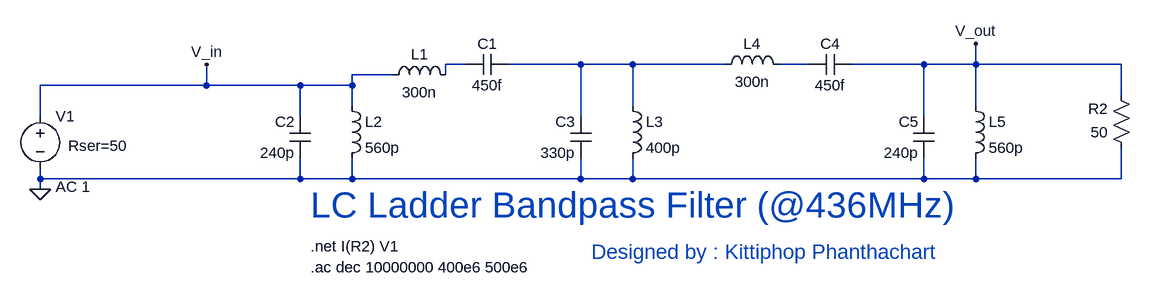
[diagram p0: schematic Bandpass 5 order fc 436.asc]
Bandpass 5 order fc 436.asc, the LTspice schematic file:
Version 4
SHEET 1 2124 680
WIRE 816 32 784 32
WIRE 992 32 880 32
WIRE 1072 32 992 32
WIRE 1216 32 1072 32
WIRE 1344 32 1296 32
WIRE 1520 32 1408 32
WIRE 1600 32 1600 0
WIRE 1600 32 1520 32
WIRE 1824 32 1600 32
WIRE 704 48 640 48
WIRE 784 48 784 32
WIRE 416 64 416 32
WIRE 416 64 160 64
WIRE 560 64 416 64
WIRE 640 64 640 48
WIRE 640 64 560 64
WIRE 1824 80 1824 32
WIRE 640 96 640 64
WIRE 1072 96 1072 32
WIRE 1600 96 1600 32
WIRE 160 112 160 64
WIRE 560 112 560 64
WIRE 992 112 992 32
WIRE 1520 112 1520 32
WIRE 160 208 160 192
WIRE 560 208 560 176
WIRE 560 208 160 208
WIRE 640 208 640 176
WIRE 640 208 560 208
WIRE 992 208 992 176
WIRE 992 208 640 208
WIRE 1072 208 1072 176
WIRE 1072 208 992 208
WIRE 1520 208 1520 176
WIRE 1520 208 1072 208
WIRE 1600 208 1600 176
WIRE 1600 208 1520 208
WIRE 1824 208 1824 160
WIRE 1824 208 1600 208
WIRE 160 224 160 208
FLAG 160 224 0
FLAG 1600 0 V_out
FLAG 416 32 V_in
DATAFLAG 480 64 "V(v_in)"
SYMBOL voltage 160 96 R0
WINDOW 123 24 124 Left 2
WINDOW 39 43 61 Left 2
SYMATTR Value2 AC 1
SYMATTR SpiceLine Rser=50
SYMATTR InstName V1
SYMATTR Value ""
SYMBOL res 1840 176 R180
WINDOW 0 36 76 Left 2
WINDOW 3 36 40 Left 2
SYMATTR InstName R2
SYMATTR Value 50
SYMBOL ind 688 64 R270
WINDOW 0 32 56 VTop 2
WINDOW 3 5 56 VBottom 2
SYMATTR InstName L1
SYMATTR Value 300n
SYMBOL cap 880 16 R90
WINDOW 0 0 32 VBottom 2
WINDOW 3 32 32 VTop 2
SYMATTR InstName C1
SYMATTR Value 450f
SYMBOL cap 576 176 R180
WINDOW 0 24 56 Left 2
WINDOW 3 24 8 Left 2
SYMATTR InstName C2
SYMATTR Value 240p
SYMBOL cap 1008 176 R180
WINDOW 0 24 56 Left 2
WINDOW 3 24 8 Left 2
SYMATTR InstName C3
SYMATTR Value 330p
SYMBOL ind 624 80 R0
SYMATTR InstName L2
SYMATTR Value 560p
SYMBOL ind 1056 80 R0
SYMATTR InstName L3
SYMATTR Value 400p
SYMBOL ind 1200 48 R270
WINDOW 0 32 56 VTop 2
WINDOW 3 5 56 VBottom 2
SYMATTR InstName L4
SYMATTR Value 300n
SYMBOL cap 1344 48 R270
WINDOW 0 32 32 VTop 2
WINDOW 3 0 32 VBottom 2
SYMATTR InstName C4
SYMATTR Value 450f
SYMBOL cap 1536 176 R180
WINDOW 0 24 56 Left 2
WINDOW 3 24 8 Left 2
SYMATTR InstName C5
SYMATTR Value 240p
SYMBOL ind 1584 80 R0
SYMATTR InstName L5
SYMATTR Value 560p
TEXT 576 344 Left 2 !.ac dec 10000000 400e6 500e6
TEXT 576 312 Left 2 !.net I(R2) V1
TEXT 1008 320 Left 3 ;Designed by : Kittiphop Phanthachart
TEXT 576 248 Left 5 ;LC Ladder Bandpass Filter (@436MHz)

The netlist it stands for:
* Bandpass 5 order fc 436.asc
V1 V_in 0 AC 1 Rser=50
R2 0 V_out 50
L1 V_in N001 300n
C1 N002 N001 450f
C2 0 V_in 240p
C3 0 N002 330p
L2 V_in 0 560p
L3 N002 0 400p
L4 N002 N003 300n
C4 N003 V_out 450f
C5 0 V_out 240p
L5 V_out 0 560p
.ac dec 10000000 400e6 500e6
.net I(R2) V1
* Designed by : Kittiphop Phanthachart
* LC Ladder Bandpass Filter (@436MHz)
.backanno
.end